# Altium schematic sheet 04_ThermistorConnection.SchDoc
size Letter
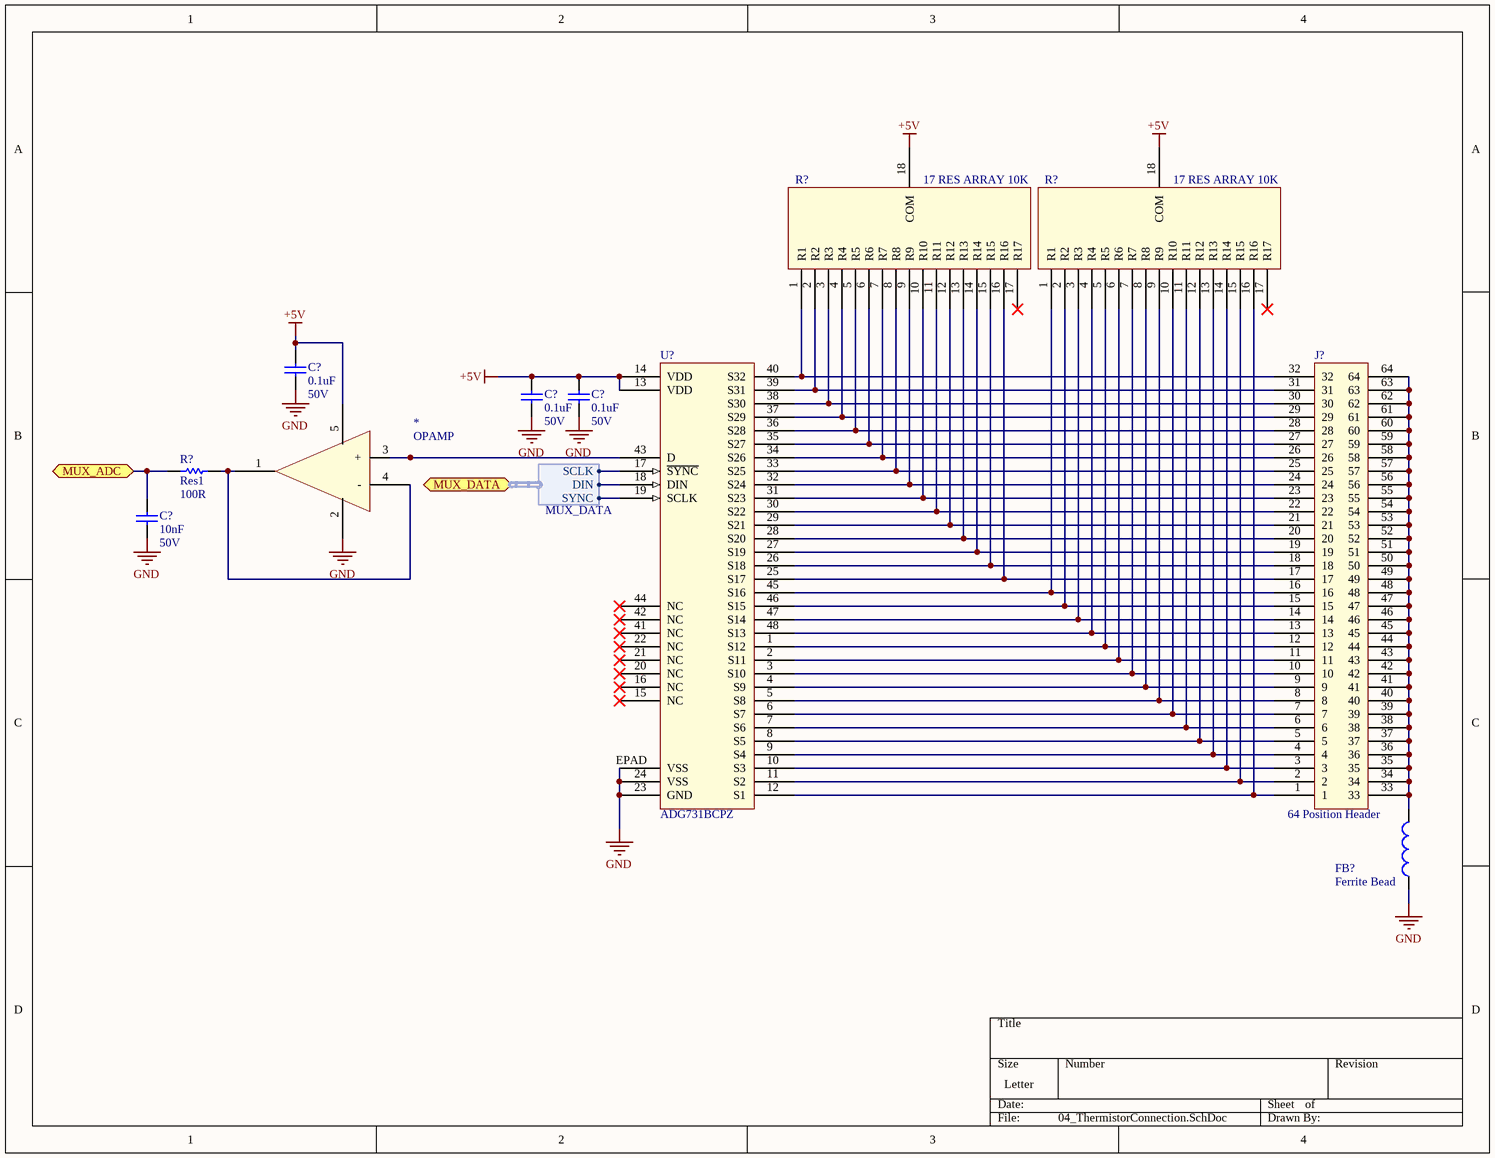
[diagram p0: 04_ThermistorConnection.SchDoc]

## Parts
(Parts that share a designator on the sheet are numbered #1, #2 ... from top to bottom, then left to right.)
*  OPAMP
C?#1  0.1uF  Voltage: 50V  [CAPC1608X06N]
C?#2  0.1uF  Voltage: 50V  [CAPC1608X06N]
C?#3  0.1uF  Voltage: 50V  [CAPC1608X06N]
C?#4  10nF  Voltage: 50V  [CAPC1608X06N]
FB?  Ferrite Bead  [0402-A]
J?  64 Position Header
R?#1  17 RES ARRAY 10K
R?#2  17 RES ARRAY 10K
R?#3  Res1  value 100R  [AXIAL-0.3]
U?  ADG731BCPZ

## Ports
MUX_ADC, MUX_DATA (harness MUX_DATA)

## Harnesses
MUX_DATA: SYNC, DIN, SCLK

## Nets
+5V: *.5 C?#1.2 C?#2.2 C?#3.2 R?#1.18(COM) R?#2.18(COM) U?.13(VDD) U?.14(VDD)
GND: *.2 C?#1.1 C?#2.1 C?#3.1 C?#4.1 FB?.1 U?.23(GND) U?.24(VSS) U?.EPAD(VSS)
MUX_ADC: C?#4.2 R?#3.1 ; port MUX_ADC
Net*_1: *.1 *.4(-) R?#3.2
Net*_3: *.3(+) U?.43(D)
NetFB?_2: FB?.2 J?.33 J?.34 J?.35 J?.36 J?.37 J?.38 J?.39 J?.40 J?.41 J?.42 J?.43 J?.44 J?.45 J?.46 J?.47 J?.48 J?.49 J?.50 J?.51 J?.52 J?.53 J?.54 J?.55 J?.56 J?.57 J?.58 J?.59 J?.60 J?.61 J?.62 J?.63 J?.64
NetJ?_1: J?.1 R?#2.16(R16) U?.12(S1)
NetJ?_2: J?.2 R?#2.15(R15) U?.11(S2)
NetJ?_3: J?.3 R?#2.14(R14) U?.10(S3)
NetJ?_4: J?.4 R?#2.13(R13) U?.9(S4)
NetJ?_5: J?.5 R?#2.12(R12) U?.8(S5)
NetJ?_6: J?.6 R?#2.11(R11) U?.7(S6)
NetJ?_7: J?.7 R?#2.10(R10) U?.6(S7)
NetJ?_8: J?.8 R?#2.9(R9) U?.5(S8)
NetJ?_9: J?.9 R?#2.8(R8) U?.4(S9)
NetJ?_10: J?.10 R?#2.7(R7) U?.3(S10)
NetJ?_11: J?.11 R?#2.6(R6) U?.2(S11)
NetJ?_12: J?.12 R?#2.5(R5) U?.1(S12)
NetJ?_13: J?.13 R?#2.4(R4) U?.48(S13)
NetJ?_14: J?.14 R?#2.3(R3) U?.47(S14)
NetJ?_15: J?.15 R?#2.2(R2) U?.46(S15)
NetJ?_16: J?.16 R?#2.1(R1) U?.45(S16)
NetJ?_17: J?.17 R?#1.16(R16) U?.25(S17)
NetJ?_18: J?.18 R?#1.15(R15) U?.26(S18)
NetJ?_19: J?.19 R?#1.14(R14) U?.27(S19)
NetJ?_20: J?.20 R?#1.13(R13) U?.28(S20)
NetJ?_21: J?.21 R?#1.12(R12) U?.29(S21)
NetJ?_22: J?.22 R?#1.11(R11) U?.30(S22)
NetJ?_23: J?.23 R?#1.10(R10) U?.31(S23)
NetJ?_24: J?.24 R?#1.9(R9) U?.32(S24)
NetJ?_25: J?.25 R?#1.8(R8) U?.33(S25)
NetJ?_26: J?.26 R?#1.7(R7) U?.34(S26)
NetJ?_27: J?.27 R?#1.6(R6) U?.35(S27)
NetJ?_28: J?.28 R?#1.5(R5) U?.36(S28)
NetJ?_29: J?.29 R?#1.4(R4) U?.37(S29)
NetJ?_30: J?.30 R?#1.3(R3) U?.38(S30)
NetJ?_31: J?.31 R?#1.2(R2) U?.39(S31)
NetJ?_32: J?.32 R?#1.1(R1) U?.40(S32)
NetU?_17: U?.17(~{SYNC}) ; port MUX_DATA.SCLK
NetU?_18: U?.18(DIN) ; port MUX_DATA.DIN
NetU?_19: U?.19(SCLK) ; port MUX_DATA.SYNC

Not connected (* = marked no-connect by the designer): R?#1 17(R17)*; R?#2 17(R17)*; U? 15(NC)* 16(NC)* 20(NC)* 21(NC)* 22(NC)* 41(NC)* 42(NC)* 44(NC)*

## Library data of the parts
C?#1-C?#3 = CAP CER 0.1UF 50V 10% X7R 0603: 0.10µF ±10% 50V Ceramic Capacitor X7R 0603 (1608 Metric); Manufacturer: AVX Corporation; ManufacturerPartNumber: 06035C104KAT2A; Value: 0.1uF; Supplier: Digi-Key; SupplierPartNumber: 478-5052-1-ND
C?#4 = CAP CER 10nF 50V 5% X7R 0603: 10000pF ±5% 50V Ceramic Capacitor U2J 0603 (1608 Metric); Manufacturer: Kemet; ManufacturerPartNumber: C0603C103J5JAC7867; Value: 10nF; Supplier: Digi-Key; SupplierPartNumber: 399-13384-1-ND
FB? = Inductor: Code_IEC: 1005; Published: 8-Jun-2000; LatestRevisionDate: 29-May-2009; LatestRevisionNote: IPC-7351 Footprint Added.; PackageReference: 0402-A; Publisher: Altium Limited; PackageDescription: Chip Inductor; Code_JEITA: 0402
J? = 64 Position Header (Temporary)
R?#3 = Res1: Resistor; Published: 8-Jun-2000; LatestRevisionDate: 17-Jul-2002; LatestRevisionNote: Re-released for DXP Platform.; PackageReference: AXIAL-0.3; Publisher: Altium Limited; PackageDescription: Axial Device, Thru-Hole; 2 Leads; 0.3 in Pin Spacing
U? = IC_MUX_ADG731BCPZ: IC MULTIPLEXER 32X1 48LFCSP; Manufacturer: Analog Devices Inc.; Supplier 1: Digi-Key; Supplier Part Number 1: ADG731BCPZ-ND; Manufacturer Part Number: ADG731BCPZ